# Altium schematic sheet Morpheus_MEM.SchDoc: Storage Sub-board
size Letter; CompanyName: Hello Inc.; DrawnBy: John Kelley; Organization: Hello Inc.; Revision: EVT2; SheetNumber: 7; SheetTotal: 8
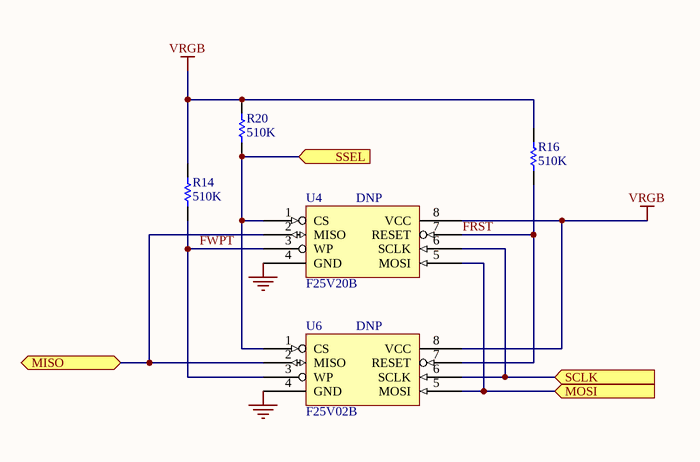
[diagram p0: Morpheus_MEM.SchDoc]

## Parts
R14  510K  [RES0402]
R16  510K  [RES0402]
R20  510K  [RES0402]
U4  DNP  PN: F25V20B  [DFN127P600x500x80-8D]
U6  DNP  PN: F25V02B  [DFN95P500x450x80-8D]

## Ports
MISO, MOSI (in), SCLK (in), SSEL (in)

## Nets
GND: U4.4(GND) U6.4(GND)
VRGB: R14.2 R16.2 R20.2 U4.8(VCC) U6.8(VCC)
FRST: R16.1 U4.7(RESET) U6.7(RESET)
FWPT: R14.1 U4.3(WP) U6.3(WP)
MISO: U4.2(MISO) U6.2(MISO) ; port MISO
MOSI: U4.5(MOSI) U6.5(MOSI) ; port MOSI
SCLK: U4.6(SCLK) U6.6(SCLK) ; port SCLK
SSEL: R20.1 U4.1(CS) U6.1(CS) ; port SSEL

## Notes on the sheet
- TITLE
- DATE
- DRAWN BY
- REV
- SHEET
- OF

## Library data of the parts
R14 R16 R20 = R_510K_5_0.1_0402: Chip Resistor; Vendor: Panasonic; Tolerance: 5 %; Power: 0.1 W; PN: ERJ-2GEJ514X; Model: *; Value: 510K; Size: 0402
U4 = FM25V20B: Cypress SPI FRAM 256Kx8; Vendor: Fujitsu
U6 = FM25V02B: Cypress SPI FRAM 32Kx8; Vendor: Fujitsu